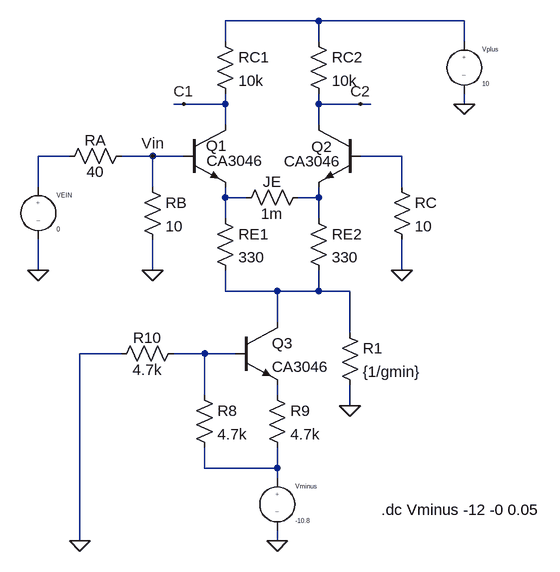
[diagram p0: schematic versuch_dv_konvergenzproblem.asc]
versuch_dv_konvergenzproblem.asc, the LTspice schematic file:
Version 4
SHEET 1 880 680
WIRE 288 -368 144 -368
WIRE 512 -368 288 -368
WIRE 144 -336 144 -368
WIRE 288 -336 288 -368
WIRE 512 -336 512 -368
WIRE 80 -240 64 -240
WIRE 144 -240 144 -256
WIRE 144 -240 80 -240
WIRE 288 -240 288 -256
WIRE 352 -240 288 -240
WIRE 368 -240 352 -240
WIRE 512 -240 512 -256
WIRE 144 -208 144 -240
WIRE 288 -208 288 -240
WIRE -96 -160 -144 -160
WIRE 32 -160 -16 -160
WIRE 80 -160 32 -160
WIRE 416 -160 352 -160
WIRE -144 -112 -144 -160
WIRE 32 -112 32 -160
WIRE 416 -112 416 -160
WIRE 144 -96 144 -112
WIRE 176 -96 144 -96
WIRE 288 -96 288 -112
WIRE 288 -96 256 -96
WIRE 144 -64 144 -96
WIRE 288 -64 288 -96
WIRE -144 16 -144 -32
WIRE 32 16 32 -32
WIRE 416 16 416 -32
WIRE 144 48 144 16
WIRE 224 48 144 48
WIRE 288 48 288 16
WIRE 288 48 224 48
WIRE 336 48 288 48
WIRE 224 96 224 48
WIRE 336 112 336 48
WIRE -16 144 -80 144
WIRE 112 144 64 144
WIRE 160 144 112 144
WIRE 112 208 112 144
WIRE 224 208 224 192
WIRE 336 224 336 192
WIRE 112 320 112 288
WIRE 224 320 224 288
WIRE 224 320 112 320
WIRE 224 336 224 320
WIRE -80 432 -80 144
WIRE 224 432 224 416
FLAG 512 -240 0
FLAG 416 16 0
FLAG 32 16 0
FLAG -144 16 0
FLAG -80 432 0
FLAG 224 432 0
FLAG 32 -160 Vin
FLAG 80 -240 C1
FLAG 352 -240 C2
FLAG 336 224 0
SYMBOL res 128 -352 R0
SYMATTR InstName RC1
SYMATTR Value 10k
SYMBOL res 272 -352 R0
SYMATTR InstName RC2
SYMATTR Value 10k
SYMBOL EIT_Semiconductors\\npn 80 -208 R0
WINDOW 0 34 32 Left 2
WINDOW 3 35 55 Left 2
SYMATTR InstName Q1
SYMATTR Value CA3046
SYMBOL EIT_Semiconductors\\npn 352 -208 M0
WINDOW 0 43 34 Left 2
WINDOW 3 31 56 Left 2
SYMATTR InstName Q2
SYMATTR Value CA3046
SYMBOL res 128 -80 R0
SYMATTR InstName RE1
SYMATTR Value 330
SYMBOL res 272 -80 R0
SYMATTR InstName RE2
SYMATTR Value 330
SYMBOL res 400 -128 R0
SYMATTR InstName RC
SYMATTR Value 10
SYMBOL res 16 -128 R0
SYMATTR InstName RB
SYMATTR Value 10
SYMBOL res -112 -144 R270
WINDOW 0 25 56 VTop 2
WINDOW 3 7 56 VBottom 2
SYMATTR InstName RA
SYMATTR Value 40
SYMBOL res 96 192 R0
SYMATTR InstName R8
SYMATTR Value 4.7k
SYMBOL res 208 192 R0
SYMATTR InstName R9
SYMATTR Value 4.7k
SYMBOL res -32 160 R270
WINDOW 0 25 56 VTop 2
WINDOW 3 7 56 VBottom 2
SYMATTR InstName R10
SYMATTR Value 4.7k
SYMBOL EIT_Semiconductors\\npn 160 96 R0
SYMATTR InstName Q3
SYMATTR Value CA3046
SYMBOL res 160 -80 R270
WINDOW 0 25 56 VTop 2
WINDOW 3 7 56 VBottom 2
SYMATTR InstName JE
SYMATTR Value 1m
SYMBOL source-V -144 -128 R0
SYMATTR InstName VEIN
SYMATTR Value 0
SYMBOL source-V 512 -352 R0
SYMATTR InstName Vplus
SYMATTR Value 10
SYMBOL source-V 224 320 R0
SYMATTR InstName Vminus
SYMATTR Value -10.8
SYMBOL res 320 96 R0
SYMATTR InstName R1
SYMATTR Value {1/gmin}
TEXT 384 384 Left 2 !.dc Vminus -12 -0 0.05

The netlist it stands for:
* versuch_dv_konvergenzproblem.asc
RC1 N001 C1 10k
RC2 N001 C2 10k
Q1 C1 Vin N004 0 CA3046
Q2 C2 N003 N005 0 CA3046
RE1 N004 N006 330
RE2 N005 N006 330
RC N003 0 10
RB Vin 0 10
RA N002 Vin 40
R8 N007 N009 4.7k
R9 N008 N009 4.7k
R10 0 N007 4.7k
Q3 N006 N007 N008 0 CA3046
R§JE N004 N005 1m
VEIN N002 0 0
Vplus N001 0 10
Vminus N009 0 -10.8
R1 N006 0 {1/gmin}
.model NPN NPN
.model PNP PNP
.lib standard.bjt
.dc Vminus -12 -0 0.05
.backanno
.end